# EAGLE design Double Socket_TEMPORARY (EAGLE 6.3)
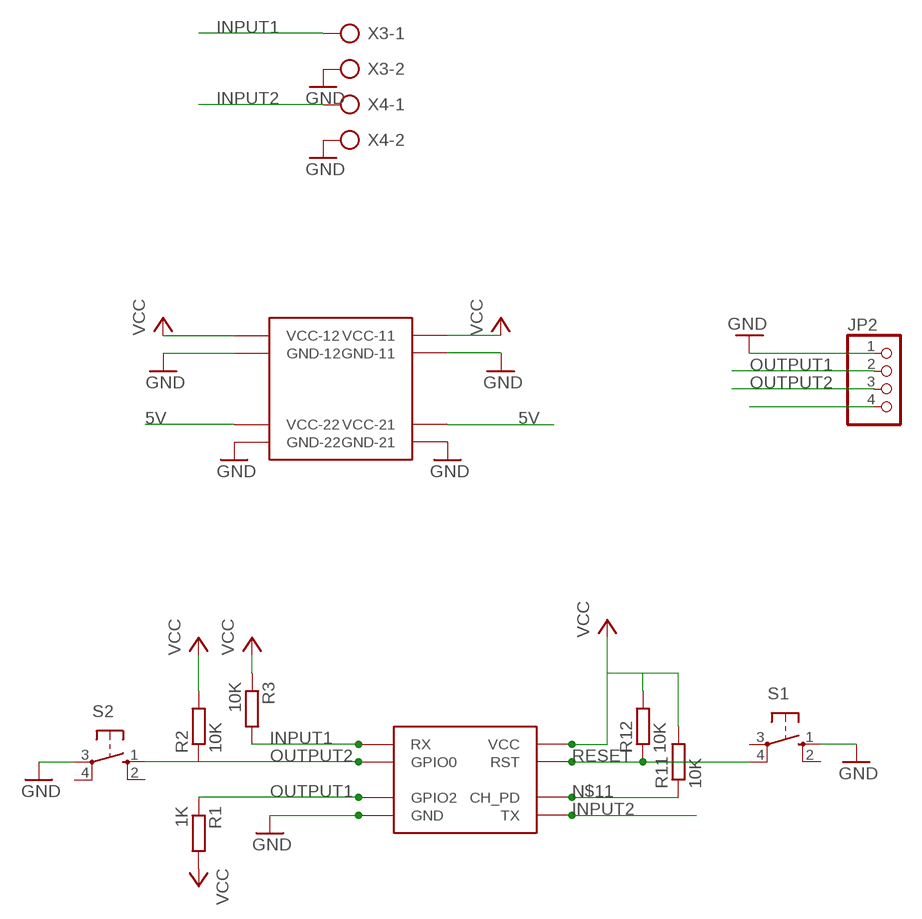
[diagram p0: schematic, sheet 1]

## Parts
JP2  PINHD-1X4  [1X04]
R1  1K  R-EU_0207/10  [0207/10]
R2  10K  R-EU_0207/10  [0207/10]
R3  10K  R-EU_0207/10  [0207/10]
R11  10K  R-EU_0207/10  [0207/10]
R12  10K  R-EU_0207/10  [0207/10]
S1  40-XX  [B3F-40XX]
S2  40-XX  [B3F-40XX]
U$1  YWROBOT  [YWROBOT]
U$2  ESP8266  [ESP8266]
X3  AK500/2-H  [AK500/2-H]
X4  AK500/2-H  [AK500/2-H]

## Nets
5V: JP2.4 U$1.VCC-21 U$1.VCC-22
GND: JP2.1 S1.1(S) S2.3(P) U$1.GND-11 U$1.GND-12 U$1.GND-21 U$1.GND-22 U$2.GND X3.2 X4.2
INPUT1: R3.2 U$2.RX X3.1
INPUT2: U$2.TX X4.1
N$11: R11.1 U$2.CH_PD
OUTPUT1: JP2.2 R1.1 U$2.GPIO2
OUTPUT2: JP2.3 R2.1 S2.1(S) U$2.GPIO0
RESET: R12.1 S1.4(P1) U$2.RST
VCC: R1.2 R2.2 R3.1 R11.2 R12.2 U$1.VCC-11 U$1.VCC-12 U$2.VCC
Unconnected: S1.2(S1) S1.3(P) S2.2(S1) S2.4(P1)

## Library data of the parts
JP2 = pinhead:PINHD-1X4: PIN HEADER
R1-R3 R11 R12 = rcl:R-EU_: RESISTOR, European symbol
S1 S2 = switch-omron:40-XX: OMRON SWITCH; MF: OMRON COMPONENTS USA; MPN: B3F-4000; OC_FARNELL: 176434; OC_NEWARK: 36K3105
U$1 = Andre:YWROBOT
U$2 = Andre:ESP8266
X3 X4 = con-ptr500:AK500/2-H: CONNECTOR Aug. 2004 / PTR Meßtechnik: Die Bezeichnung der Serie AK505 wurde geändert. Es handelt sich hierbei um AK500 in horizontaler Ausführung.

## Board
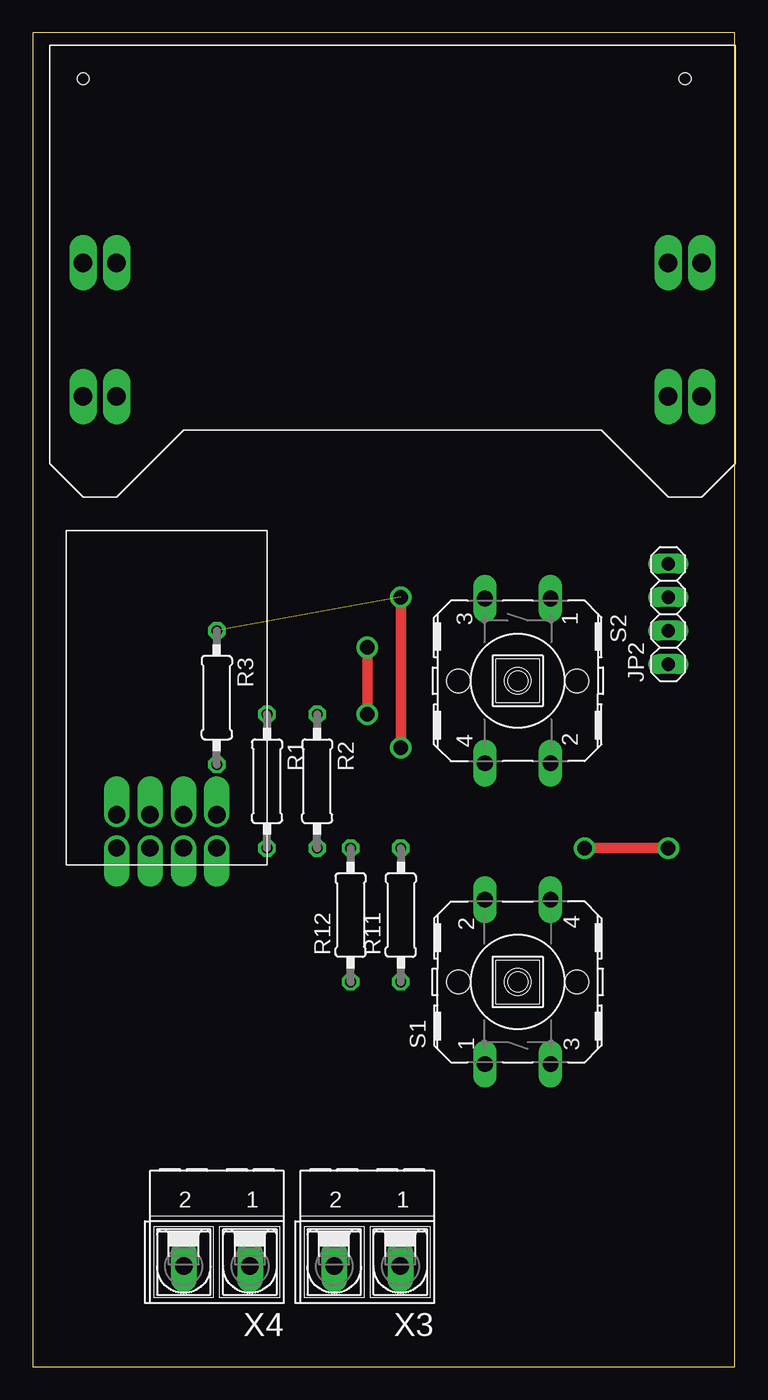
[diagram p1: board, top side]
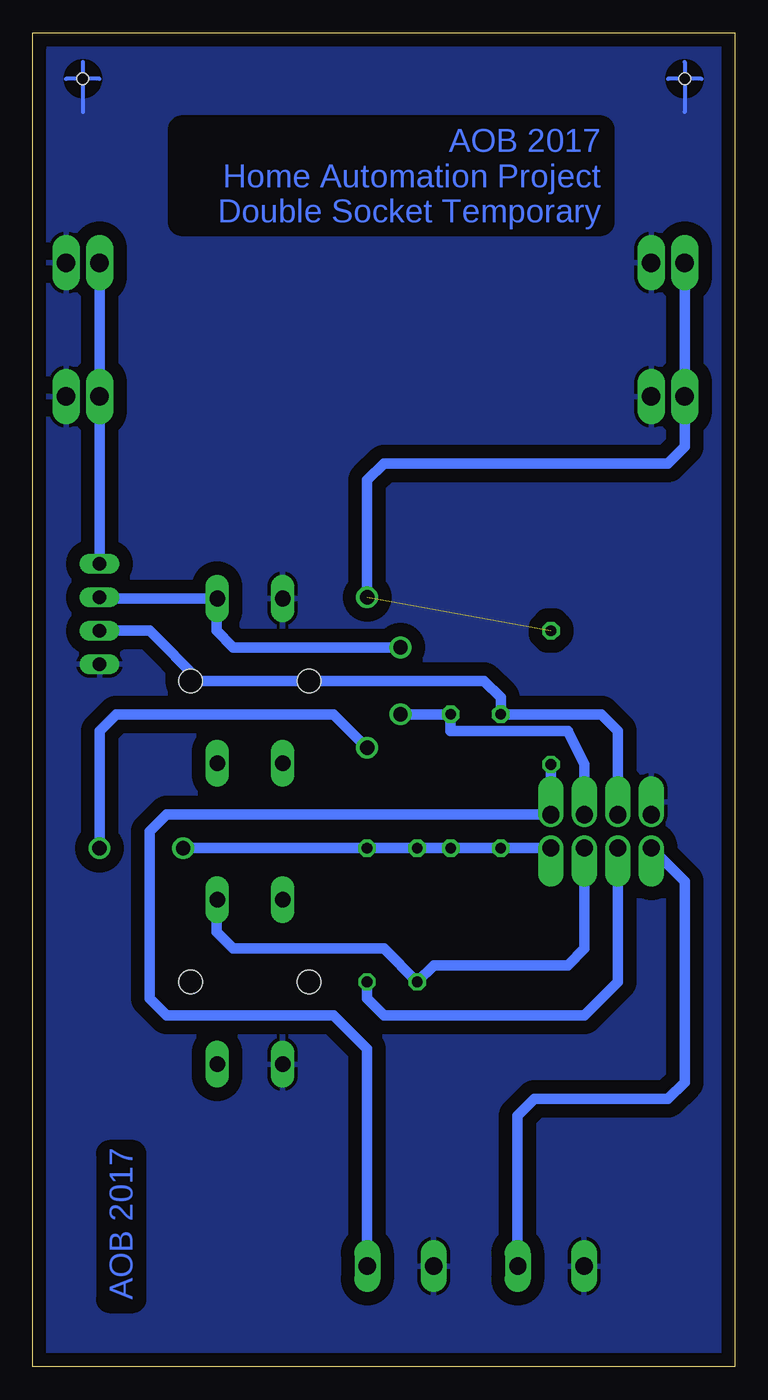
[diagram p2: board, bottom side, seen from below]

Size 53.32 x 101.27 mm. Coordinates in mm from the lower left corner, seen from the top.
Outline: 0,0 53.32,0 53.32,101.27 0,101.27 0,0
Copper layers (1*16): Top 0.035mm / dielectric 1.5mm / Bottom 0.035mm
Design rules "default": minimum track width 10mil, minimum drill 24mil, track to track 8mil, track to pad 8mil, pad to pad 8mil, via to via 8mil, smd to smd 8mil, copper to edge 40mil, drill to drill 8mil, minimum pad ring 10mil, minimum via ring 8mil, stop-mask expansion 4mil, vias tented up to drill 0mil, thermal gap 10mil
Holes 0.9 mm at 49.53,97.79 3.81,97.79

### Footprints (pad centres in the part's own frame; a part is rotated, then mirrored left to right if it is on the bottom)
1X04 = drill 1.016 long: 1 -3.81,0; 2 -1.27,0; 3 1.27,0; 4 3.81,0
0207/10 = drill 0.813 octagon: 1 -5.08,0; 2 5.08,0
B3F-40XX = drill 1.194 long: 1 -6.248,2.489; 2 6.248,2.489; 3 -6.248,-2.489; 4 6.248,-2.489 | hole 1.803: 0,-4.496; 0,4.496
YWROBOT = drill 1.4 long: GND-11 -20.32,-1.27; GND-12 -20.32,-11.43; GND-21 24.13,-1.27; GND-22 24.13,-11.43; VCC-11 -22.86,-1.27; VCC-12 -22.86,-11.43; VCC-21 21.59,-1.27; VCC-22 21.59,-11.43
ESP8266 = drill 1.3 offset: CH_PD -1.27,-11.43; GND -3.81,-8.89; GPIO0 1.27,-8.89; GPIO2 -1.27,-8.89; RST 1.27,-11.43; RX 3.81,-8.89; TX -3.81,-11.43; VCC 3.81,-11.43
AK500/2-H = drill 1.321 long: 1 -2.515,0; 2 2.515,0

### Placement (x,y rotation side)
JP2  48.26,57.15 90 top
R1  17.78,44.45 270 top
R2  21.59,44.45 270 top
R3  13.97,50.8 270 top
R11  27.94,34.29 90 top
R12  24.13,34.29 90 top
S1  36.83,29.21 90 top
S2  36.83,52.07 270 top
U$1  26.67,85.09 0 top
U$2  10.16,50.8 0 top
X3  25.4,7.62 180 top
X4  13.97,7.62 180 top

### Tracks (layer width: path | path; a pad name or v marks a point on that pad's centre or on a via)
5V
  Bottom 0.813: U$1.VCC-21 U$1.VCC-22 JP2.4
GND
  Bottom 0.305: 2.54,97.79 3.81,97.79 | 3.81,97.79 5.08,97.79 | 3.81,97.79 3.81,95.25 | 49.53,99.06 49.53,97.79 | 49.53,97.79 49.53,95.25 | 49.53,97.79 50.8,97.79 | 48.26,97.79 49.53,97.79 | 3.81,99.06 3.81,97.79
  pour Bottom (isolate 1.016): 0,0 53.34,0 52.07,101.6 0,101.6
INPUT1
  Bottom 0.813: R3.2 U$2.RX 43.18,41.91 44.45,40.64 44.45,27.94 43.18,26.67 30.48,26.67 27.94,24.13 27.94,7.64 X3.1
INPUT2
  Bottom 0.813: 16.51,7.62 X4.1 16.51,7.64 16.51,19.05 15.24,20.32 5.08,20.32 3.81,21.59 3.81,36.83 U$2.TX
N$11
  Bottom 0.813: U$2.CH_PD 8.89,29.21 11.43,26.67 26.67,26.67 27.94,27.94 R11.1
OUTPUT1
  Bottom 0.813: U$2.GPIO2 8.89,48.26 10.16,49.53 R1.1 17.78,50.8 19.05,52.07 40.64,52.07 44.45,55.88 JP2.2
OUTPUT2  (via drill 1.1)
  Top 0.813: v25.4,49.53 v25.4,54.61
  Bottom 0.813: U$2.GPIO0 11.43,45.72 12.7,48.26 21.59,48.26 R2.1 v25.4,49.53 | JP2.3 48.16,58.32 S2.1 39.37,58.27 39.37,55.88 38.1,54.61 v25.4,54.61
RESET
  Bottom 0.813: U$2.RST 11.43,31.75 12.7,30.48 22.86,30.48 R12.1 26.67,31.75 38.1,31.75 39.37,33.02 39.37,35.41 S1.4
VCC  (via drill 1.1)  (1 unrouted)
  Top 0.813: v27.94,58.42 v27.94,46.99 | v48.26,39.37 v41.91,39.37
  Bottom 0.813: U$1.VCC-11 U$1.VCC-12 3.81,69.85 5.08,68.58 26.67,68.58 27.94,67.31 v27.94,58.42 | U$2.VCC R1.2 R2.2 R12.2 R11.2 v41.91,39.37 | v27.94,46.99 30.48,49.53 46.99,49.53 48.26,48.26 v48.26,39.37

### Text on the board
Bottom: AOB 2017 / Home Automation Project / Double Socket Temporary | AOB 2017